# EasyEDA schematic AltairLCD.json
TITLE: Altair RA8875 LCD Connector Board; REV: 1.0; Date: 2020-05-21; Sheet: 1/1; Drawn By: David Williams; Company: Yuri Williams, Inc.
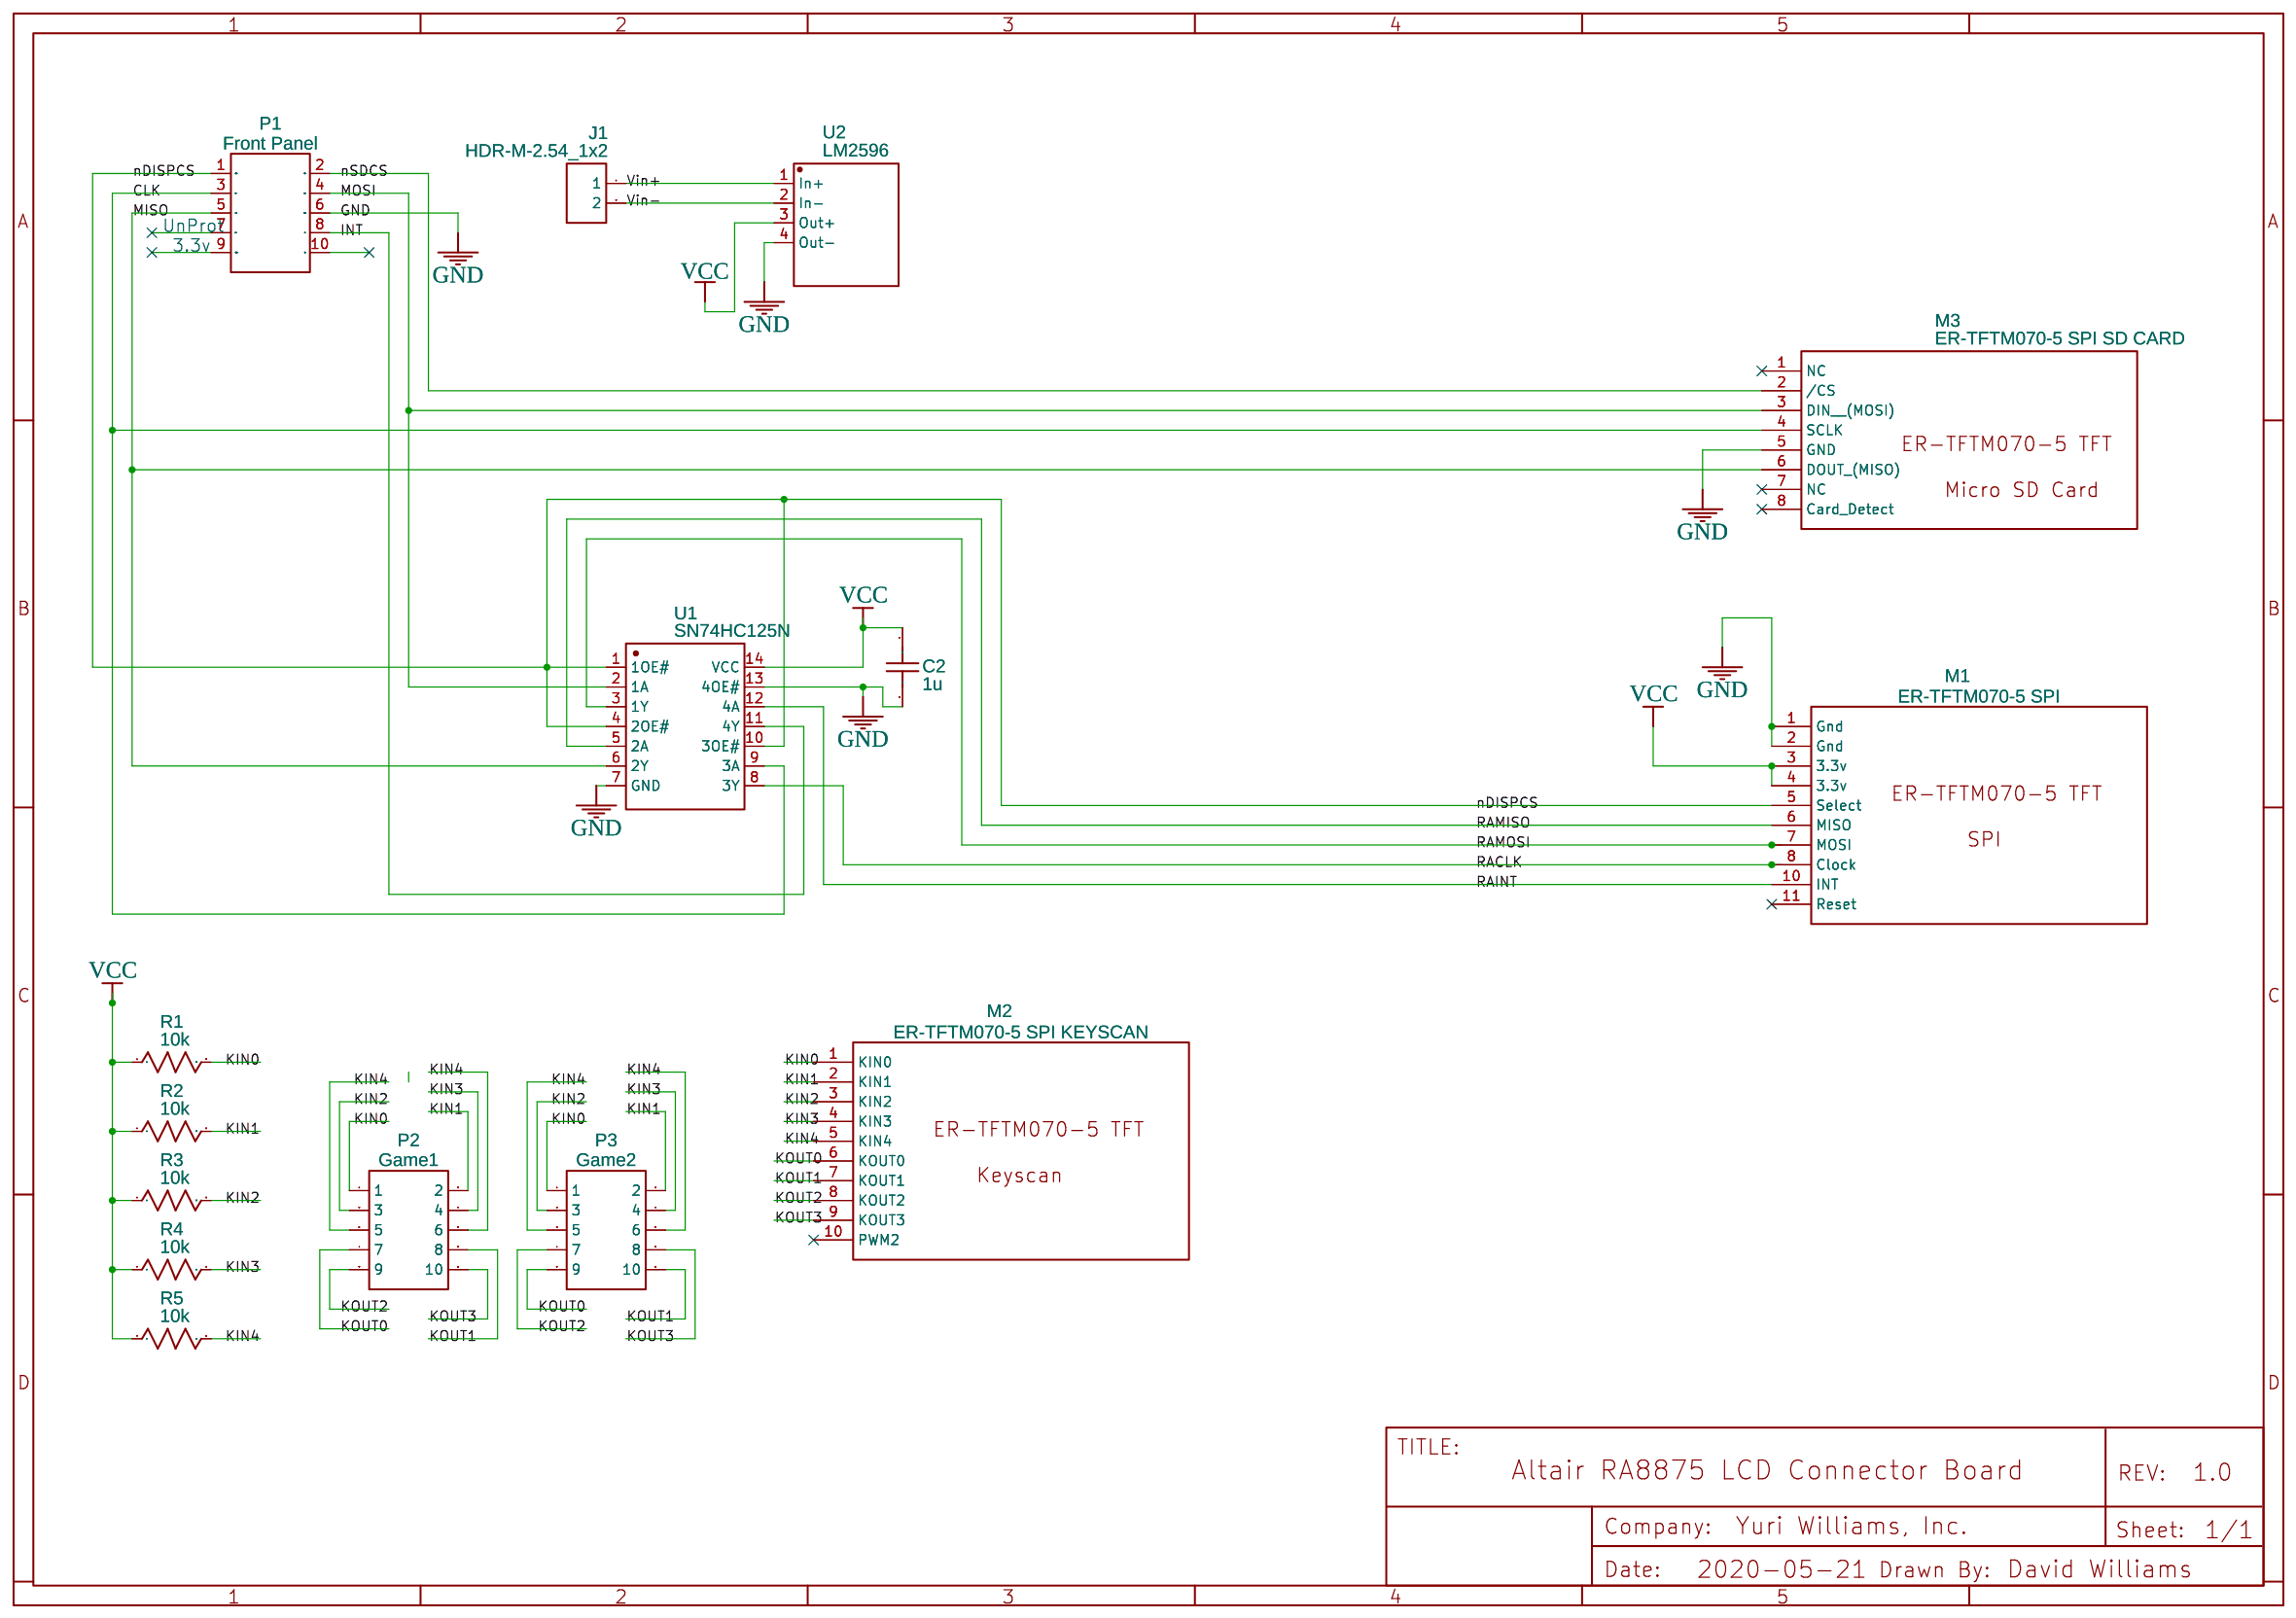
[diagram p0: schematic sheet]

## Parts
C2  1u  [RAD-0.1]
J1  HDR-M-2.54_1x2  [HDR-M-2.54_1X2]
M1  ER-TFTM070-5 SPI  [HDR-F-2.54_2X20]
M2  ER-TFTM070-5 SPI KEYSCAN  [HDR-F-2.54_2X5]
M3  ER-TFTM070-5 SPI SD CARD  [HDR-M-2.54_2X4]
P1  Front Panel  [HDR-M-2.54_2X5]
P2  Game1  [HDR-M-2.54_2X5]
P3  Game2  [HDR-M-2.54_2X5]
R1  10k  [R_AXIAL-0.3]
R2  10k  [R_AXIAL-0.3]
R3  10k  [R_AXIAL-0.3]
R4  10k  [R_AXIAL-0.3]
R5  10k  [R_AXIAL-0.3]
U1  SN74HC125N  [DIP-14_L19.0-W7.0-P2.54-LS7.6-BL]
U2  LM2596  [LM2596-MODULE]

## Library data of the parts
C2 = C_RAD-0.1_US: Contributor: LCEDA_Lib
J1 = HDR-M-2.54_1x2: Supplier Part: C124375; Supplier: LCSC; Contributor: LCEDA_Lib
M1 = ER-TFTM070-5 SPI: Manufacturer Part: CD74HC125M; Supplier Part: ER-TFTM070-5; link: http://www.buydisplay.com; Contributor: KB1HFT; subpart_no: 2; Package Display: No
M2 = ER-TFTM070-5 SPI KEYSCAN: Manufacturer Part: CD74HC125M; Supplier: EastRising; Supplier Part: ER-TFTM070-5; link: http://www.buydisplay.com; Contributor: KB1HFT; subpart_no: 2
M3 = ER-TFTM070-5 SPI SD CARD: Manufacturer Part: CD74HC125M; Supplier: EastRising; Supplier Part: ER-TFTM070-5; link: http://www.buydisplay.com; Contributor: KB1HFT; subpart_no: 2
P1 = HDR-IDC-2.54-2X5P: Supplier: LCSC; Manufacturer: BOOMELE; Manufacturer Part: IDC Box 2.54mm 2X5P; image: //image.lceda.cn/szlcsc/C5665.jpg; Supplier Part: C5665; Package Display: No
P2 P3 = HDR-IDC-2.54-2X5P: Supplier: LCSC; Manufacturer: BOOMELE; Manufacturer Part: IDC Box 2.54mm 2X5P; image: //image.lceda.cn/szlcsc/C5665.jpg; Supplier Part: C5665
R1-R5 = R_AXIAL-0.3_US: Contributor: LCEDA_Lib
U1 = SN74HC125N: Supplier: LCSC; Manufacturer: TI; image: //image.lceda.cn/szlcsc/C2890.jpg; Supplier Part: C2890
U2 = LM2596

## Nets
GND: C2.2 M1.1(Gnd) M1.2(Gnd) M3.5(GND) P1.6(nSDCS) U1.7(GND) U1.13(4OE#) U2.4(Out-)
VCC: C2.1 M1.3(3.3v) M1.4(3.3v) R1.1 R2.1 R3.1 R4.1 R5.1 U1.14(VCC) U2.3(Out+)
Vin+: J1.1 U2.1(In+)
Vin-: J1.2 U2.2(In-)
CLK: M3.4(SCLK) P1.3(CLK) U1.9(3A)
INT: P1.8(INT) U1.11(4Y)
KIN0: M2.1(KIN0) P2.1 P3.1 R1.2
KIN1: M2.2(KIN1) P2.2 P3.2 R2.2
KIN2: M2.3(KIN2) P2.3 P3.3 R3.2
KIN3: M2.4(KIN3) P2.4 P3.4 R4.2
KIN4: M2.5(KIN4) P2.5 P2.6 P3.5 P3.6 R5.2
KOUT0: M2.6(KOUT0) P2.7 P3.9
KOUT1: M2.7(KOUT1) P2.8 P3.10
KOUT2: M2.8(KOUT2) P2.9 P3.7
KOUT3: M2.9(KOUT3) P2.10 P3.8
MISO: M3.6(DOUT (MISO)) P1.5(MISO) U1.6(2Y)
MOSI: M3.3(DIN  (MOSI)) P1.4(MOSI) U1.2(1A)
nDISPCS: M1.5(Select) P1.1(nDISPCS) U1.1(1OE#) U1.4(2OE#) U1.10(3OE#)
nSDCS: M3.2(/CS) P1.2(GND)
RACLK: M1.8(Clock) U1.8(3Y)
RAINT: M1.10(INT) U1.12(4A)
RAMISO: M1.6(MISO) U1.5(2A)
RAMOSI: M1.7(MOSI) U1.3(1Y)

Not connected (* = marked no-connect by the designer): M1 11(Reset)*; M2 10(PWM2)*; M3 1(NC)* 7(NC)* 8(Card Detect)*; P1 7(GP) 9(ALTAIR3.3v) 10(NC)

## Notes on the sheet
- UnProt
- 3.3v
